# EAGLE design mic4606_power (EAGLE 6.4)

## Sheet 1 of 2
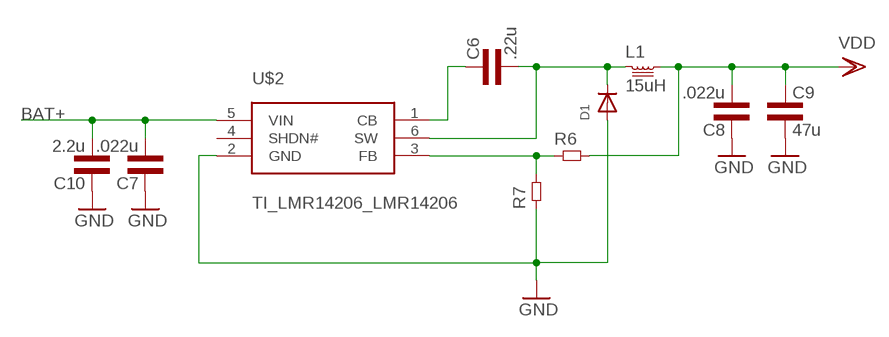
[diagram p0: schematic, sheet 1]

### Parts
C6  .22u  CAP0603L3  [0603L3]
C7  .022u  CAP0603L3  [0603L3]
C8  .022u  CAP0603L3  [0603L3]
C9  47u  CAP1210L3  [1210L3]
C10  2.2u  CAP1210L3  [1210L3]
D1  ADAFRUIT_DIODESMA  [ADAFRUIT_SMADIODE]
L1  15uH  NRG4026  [NR4026]
R6  RES0603L3  [0603L3]
R7  RES0603L3  [0603L3]
U$2  TI_LMR14206_LMR14206  [TI_LMR14206_R-PDSO-G6]

### Nets
BAT+: C7.P$2 C10.P$2 U$2.5(VIN) ; also sheet 2
CB: C6.P$1 U$2.1(CB)
FB: R6.P$1 R7.P$2 U$2.3(FB)
GND: C7.P$1 C8.P$1 C9.P$2 C10.P$1 D1.A R7.P$1 U$2.2(GND) ; also sheet 2
SW: C6.P$2 D1.C L1.E U$2.6(SW)
VDD: C8.P$2 C9.P$1 L1.F R6.P$2
Unconnected: U$2.4(SHDN#)

## Sheet 2 of 2
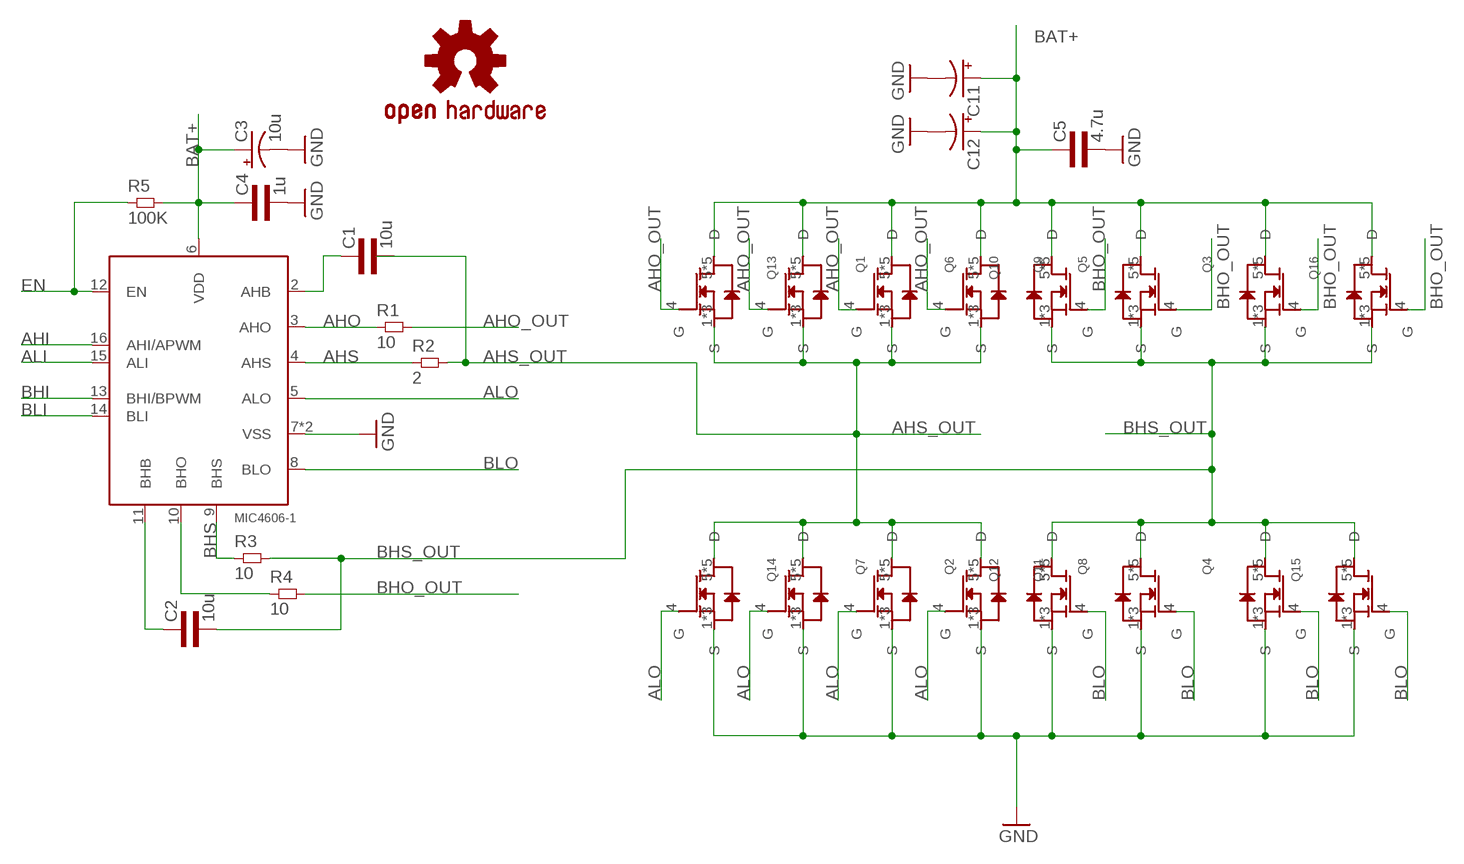
[diagram p1: schematic, sheet 2]

### Parts
C1  10u  CAP0805L3  [0805L3]
C2  10u  CAP0805L3  [0805L3]
C3  10u  CPOL-USE1.8-4  [E1,8-4]
C4  1u  CAP0603L3  [0603L3]
C5  4.7u  CAP0805L3  [0805L3]
C11  CPOL-USF  [PANASONIC_F]
C12  CPOL-USF  [PANASONIC_F]
LOGO1  OSHW-LOGOM  [OSHW-LOGO-M]
MD1  MIC4606-1  [QFN44-16LD-PL-2]
Q1  CSD18540Q5B  [Q5B]
Q2  CSD18540Q5B  [Q5B]
Q3  CSD18540Q5B  [Q5B]
Q4  CSD18540Q5B  [Q5B]
Q5  CSD18540Q5B  [Q5B]
Q6  CSD18540Q5B  [Q5B]
Q7  CSD18540Q5B  [Q5B]
Q8  CSD18540Q5B  [Q5B]
Q9  CSD18540Q5B  [Q5B]
Q10  CSD18540Q5B  [Q5B]
Q11  CSD18540Q5B  [Q5B]
Q12  CSD18540Q5B  [Q5B]
Q13  CSD18540Q5B  [Q5B]
Q14  CSD18540Q5B  [Q5B]
Q15  CSD18540Q5B  [Q5B]
Q16  CSD18540Q5B  [Q5B]
R1  10  RES0805L3  [0805L3]
R2  2  RES0805L3  [0805L3]
R3  10  RES0805L3  [0805L3]
R4  10  RES0805L3  [0805L3]
R5  100K  RES0603L3  [0603L3]

### Nets
AHI: MD1.16(AHI/APWM)
AHO: MD1.3(AHO) R1.1
AHO_OUT: Q1.4(G) Q6.4(G) Q9.4(G) Q13.4(G) R1.2
AHS: MD1.4(AHS) R2.1
AHS_OUT: C1.2 Q1.1(S) Q1.2(S) Q1.3(S) Q2.5(D) Q2.6(D) Q2.7(D) Q2.8(D) Q2.9(D) Q6.1(S) Q6.2(S) Q6.3(S) Q7.5(D) Q7.6(D) Q7.7(D) Q7.8(D) Q7.9(D) Q9.1(S) Q9.2(S) Q9.3(S) Q11.5(D) Q11.6(D) Q11.7(D) Q11.8(D) Q11.9(D) Q13.1(S) Q13.2(S) Q13.3(S) Q14.5(D) Q14.6(D) Q14.7(D) Q14.8(D) Q14.9(D) R2.2
ALI: MD1.15(ALI)
ALO: MD1.5(ALO) Q2.4(G) Q7.4(G) Q11.4(G) Q14.4(G)
BAT+: C3.+ C4.P$1 C5.1 C11.+ C12.+ MD1.6(VDD) Q1.5(D) Q1.6(D) Q1.7(D) Q1.8(D) Q1.9(D) Q3.5(D) Q3.6(D) Q3.7(D) Q3.8(D) Q3.9(D) Q5.5(D) Q5.6(D) Q5.7(D) Q5.8(D) Q5.9(D) Q6.5(D) Q6.6(D) Q6.7(D) Q6.8(D) Q6.9(D) Q9.5(D) Q9.6(D) Q9.7(D) Q9.8(D) Q9.9(D) Q10.5(D) Q10.6(D) Q10.7(D) Q10.8(D) Q10.9(D) Q13.5(D) Q13.6(D) Q13.7(D) Q13.8(D) Q13.9(D) Q16.5(D) Q16.6(D) Q16.7(D) Q16.8(D) Q16.9(D) R5.P$2 ; also sheet 1
BHI: MD1.13(BHI/BPWM)
BHO: MD1.10(BHO) R4.1
BHO_OUT: Q3.4(G) Q5.4(G) Q10.4(G) Q16.4(G) R4.2
BHS: MD1.9(BHS) R3.1
BHS_OUT: C2.2 Q3.1(S) Q3.2(S) Q3.3(S) Q4.5(D) Q4.6(D) Q4.7(D) Q4.8(D) Q4.9(D) Q5.1(S) Q5.2(S) Q5.3(S) Q8.5(D) Q8.6(D) Q8.7(D) Q8.8(D) Q8.9(D) Q10.1(S) Q10.2(S) Q10.3(S) Q12.5(D) Q12.6(D) Q12.7(D) Q12.8(D) Q12.9(D) Q15.5(D) Q15.6(D) Q15.7(D) Q15.8(D) Q15.9(D) Q16.1(S) Q16.2(S) Q16.3(S) R3.2
BLI: MD1.14(BLI)
BLO: MD1.8(BLO) Q4.4(G) Q8.4(G) Q12.4(G) Q15.4(G)
EN: MD1.12(EN) R5.P$1
GND: C3.- C4.P$2 C5.2 C11.- C12.- MD1.7(VSS) MD1.TP(VSS) Q2.1(S) Q2.2(S) Q2.3(S) Q4.1(S) Q4.2(S) Q4.3(S) Q7.1(S) Q7.2(S) Q7.3(S) Q8.1(S) Q8.2(S) Q8.3(S) Q11.1(S) Q11.2(S) Q11.3(S) Q12.1(S) Q12.2(S) Q12.3(S) Q14.1(S) Q14.2(S) Q14.3(S) Q15.1(S) Q15.2(S) Q15.3(S) ; also sheet 1
N$1: C1.1 MD1.2(AHB)
N$9: C2.1 MD1.11(BHB)

## Library data of the parts
C1 C2 C4-C10 = common:CAP
C3 C11 C12 = rcl:CPOL-US: POLARIZED CAPACITOR, American symbol
D1 = logic_vB:ADAFRUIT_DIODE: Diode SMADIODE - SMA Surface Mount Package 20V 1A Schottky Diode Digikey: 641-1014-6-ND DO-1N4148 - Through Hole Small Current Diode SOD-123 20V 1 A (.5mV Vf) Schottky Diode - Digikey: MBRX120TPMSCT-ND SOD-323 10V 570mA (.38mV Vf, 3ns) Schottky Diode - Digikey: ZLLS410CT-ND SOD-523 30V 30mA Schottky Diode (RB751S-40TE61) - Digikey: RB751S-40TE61CT-ND SOT23-R/W - SOT23 Package (R = Solder Paste/Reflow Ovens, W = Hand-Soldering) BAT54Film 40V 300mA - Digikey: 497-7162-1-ND
L1 = common:NRG4026
LOGO1 = SparkFun-Aesthetics:OSHW-LOGO: Open Source Hardware Logo This logo indicates the piece of hardware it is found on incorporates a OSHW license and/or adheres to the definition of open source hardware found here: http://freedomdefined.org/OSHW
MD1 = common:MIC4606: 85V Full-Bridge Mosfet Driver
Q1-Q16 = common:CSD18540Q5B: N-Channel High-Power MosFET; I_MAX: 221A; PD: 195W; PULSED_DRAIN_CURRENT: 400A; VGS: +/- 20V; V_MAX: 60V
R1-R7 = common:RES
U$2 = logic_vB:TI_LMR14206_LMR14206

## Board
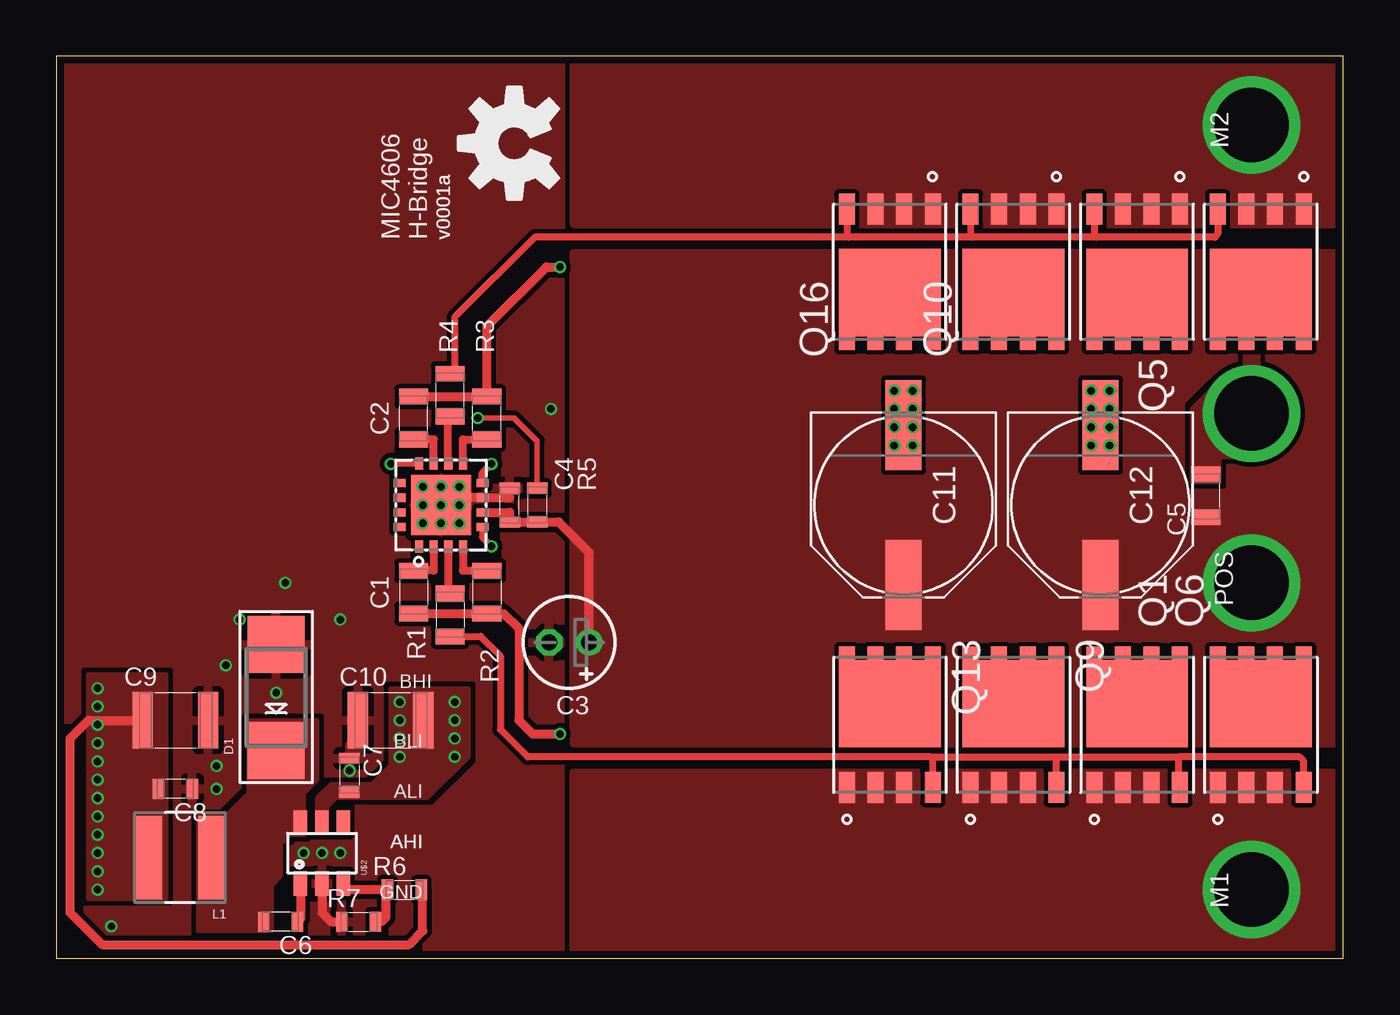
[diagram p2: board, top side]
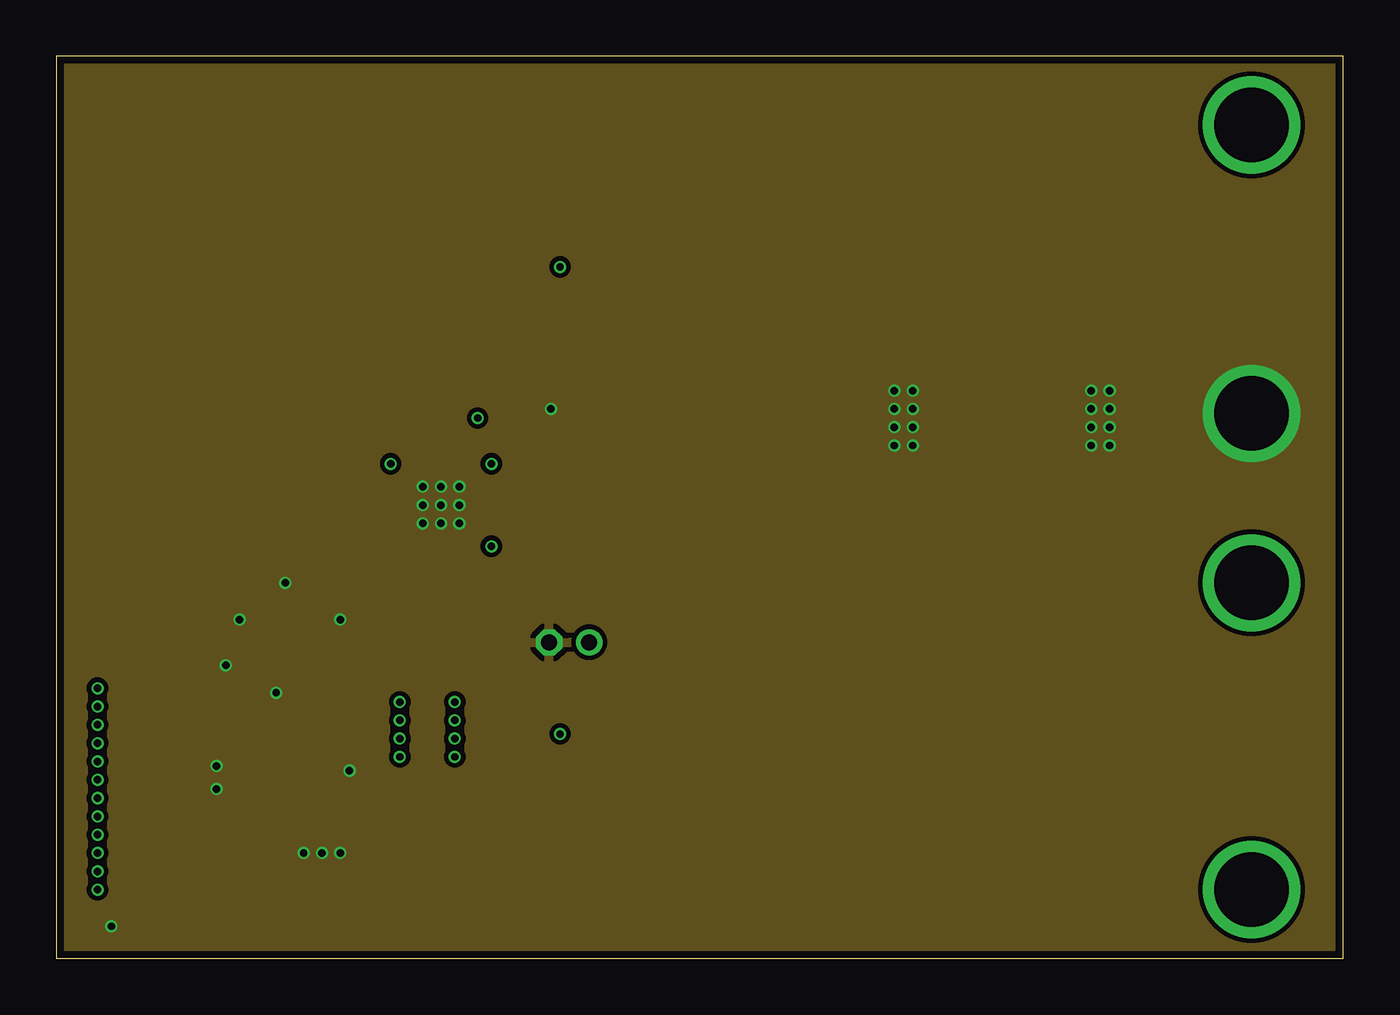
[diagram p3: board, inner layer Route2]
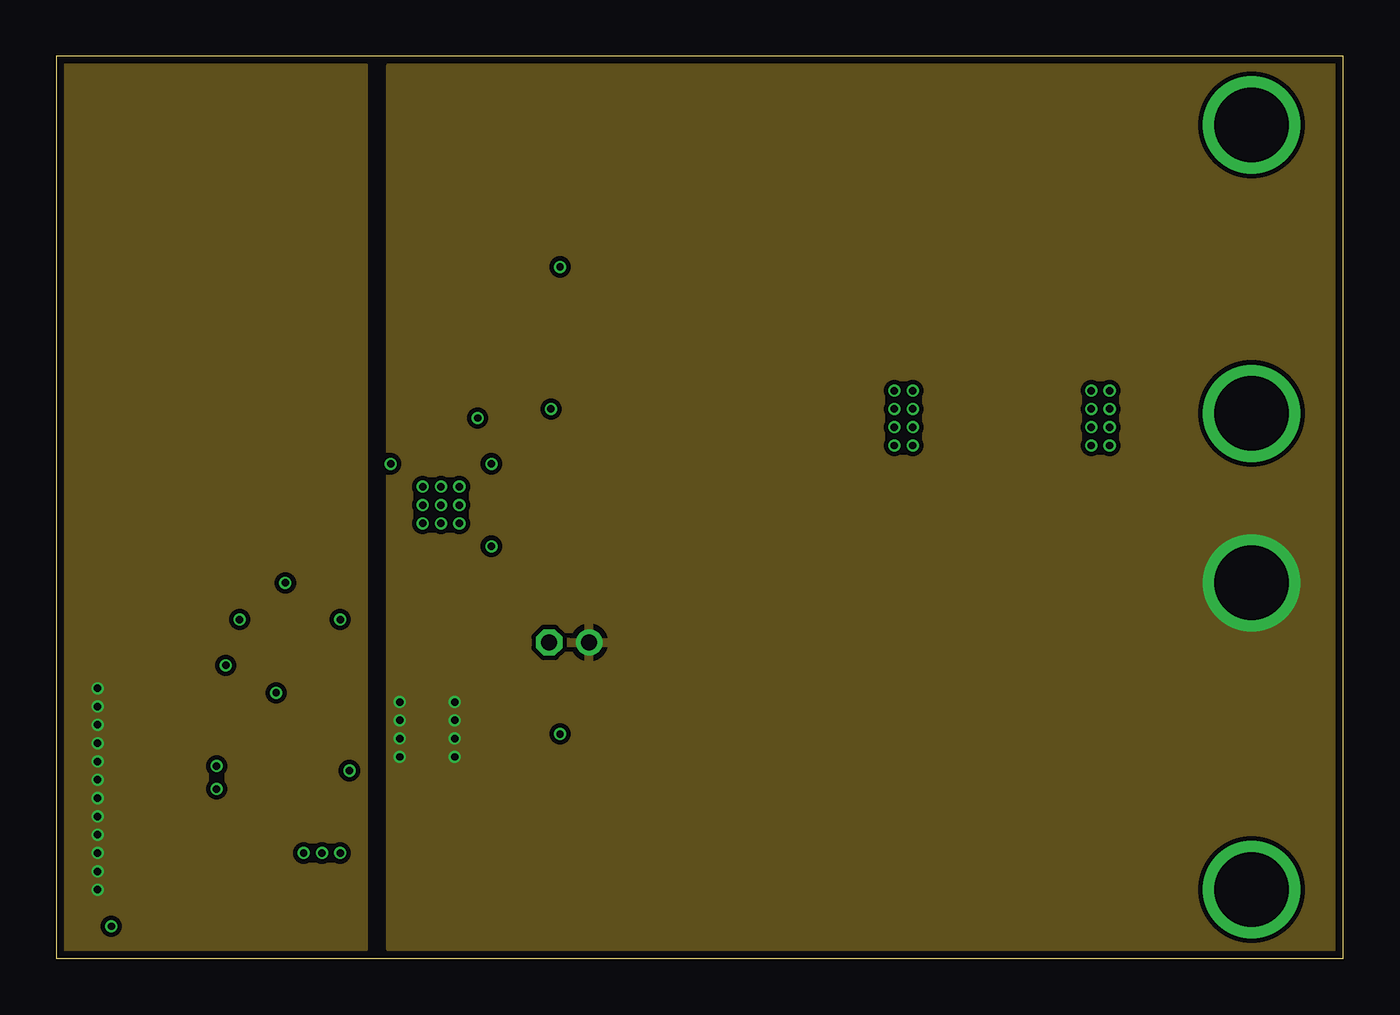
[diagram p4: board, inner layer Route3]
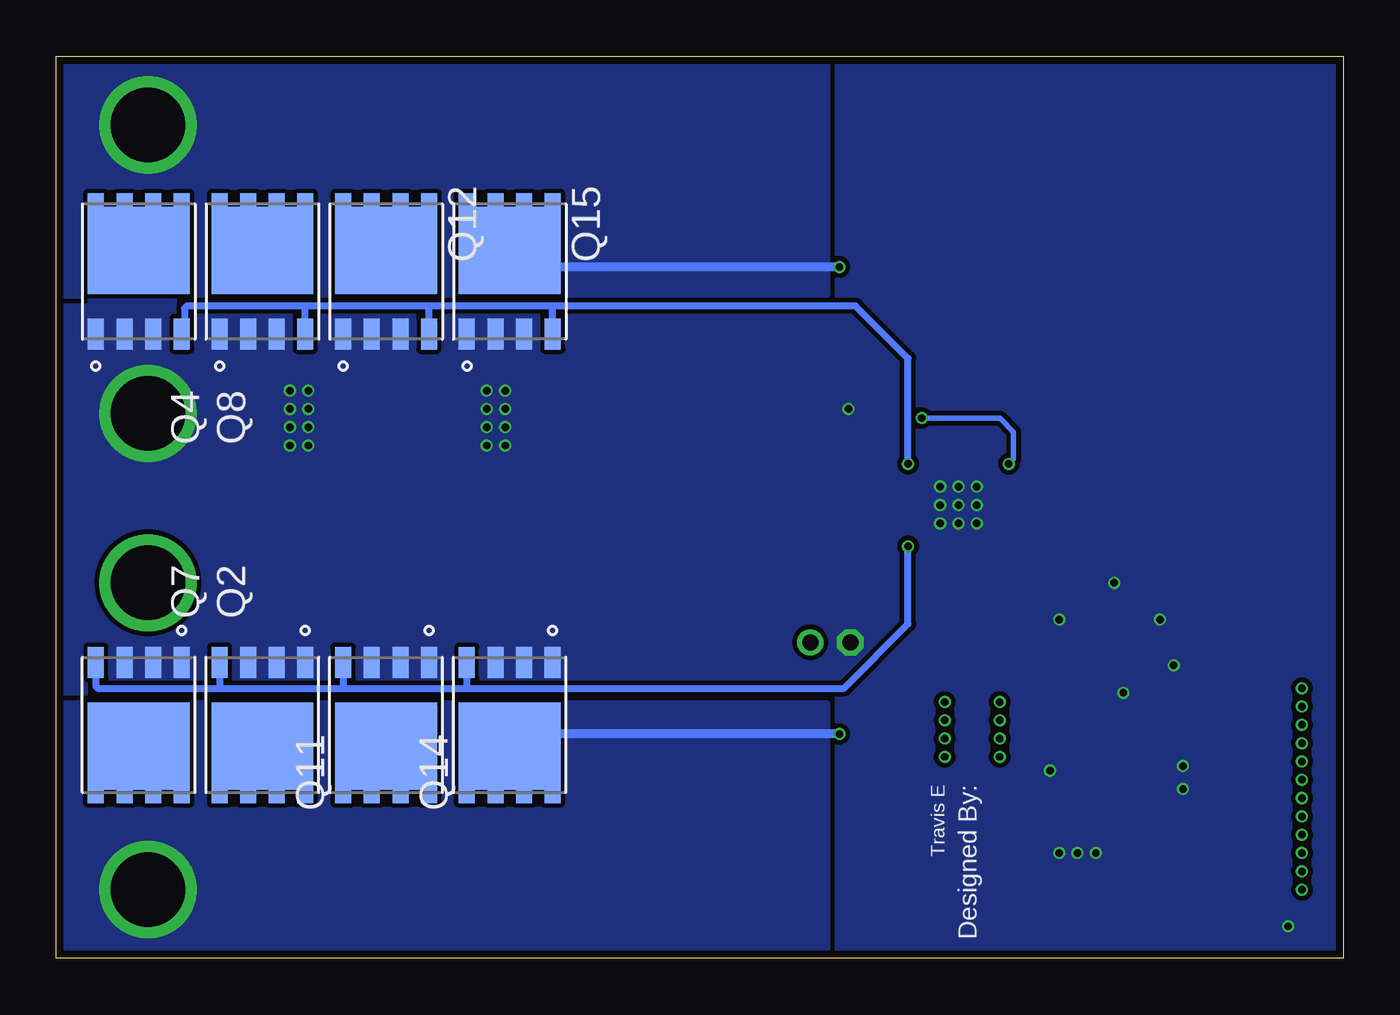
[diagram p5: board, bottom side, seen from below]

Size 57.1 x 40.03 mm. Coordinates in mm from the lower left corner, seen from the top.
Outline: 57.1,0 57.1,40.03 0,40.03 0,0 57.1,0
Copper layers (1*2*3*16): Top 0.035mm / dielectric 1.5mm / Route2 0.035mm / dielectric 0.15mm / Route3 0.035mm / dielectric 0.2mm / Bottom 0.035mm
Design rules "default *": minimum track width 8mil, minimum drill 13mil, track to track 8mil, track to pad 8mil, pad to pad 8mil, via to via 8mil, smd to smd 8mil, copper to edge 13mil, drill to drill 8mil, minimum pad ring 4mil, minimum via ring 4mil, stop-mask expansion 4mil, vias tented up to drill 13mil, thermal gap 10mil

### Footprints (pad centres in the part's own frame; a part is rotated, then mirrored left to right if it is on the bottom)
0805L3 = smd 0.7 x 1.3: 1 -0.95,0; 2 0.95,0
E1,8-4 = drill 0.711 pad 1.168: + -0.889,0 | drill 0.711 pad 1.168 octagon: - 0.889,0
0603L3 = smd 0.5 x 0.9: P$1 -0.75,0; P$2 0.75,0
1210L3 = smd 0.9 x 2.5: P$1 -1.45,0; P$2 1.45,0
PANASONIC_F = smd 4 x 1.6: + 3.55,0; - -3.55,0
ADAFRUIT_SMADIODE = smd 2.54 x 2.54: A 2.349,0; C -2.349,0
NR4026 = smd 1.2 x 3.7: E -1.4,0; F 1.4,0
QFN44-16LD-PL-2 = smd 0.53 x 0.36: 1 -1.835,0.975; 2 -1.835,0.325; 3 -1.835,-0.325; 4 -1.835,-0.975; 9 1.835,-0.975; 10 1.835,-0.325; 11 1.835,0.325; 12 1.835,0.975 | smd 0.36 x 0.53: 5 -0.975,-1.835; 6 -0.325,-1.835; 7 0.325,-1.835; 8 0.975,-1.835; 13 0.975,1.835; 14 0.325,1.835; 15 -0.325,1.835; 16 -0.975,1.835 | smd 2.65 x 2.65: TP 0,0
Q5B = smd 1.372 x 0.71: 1 2.77,-1.905; 2 2.77,-0.635; 3 2.77,0.635; 4 2.77,1.905 | smd 0.59 x 0.71: 5 -3.161,1.905; 6 -3.161,0.635; 7 -3.161,-0.635; 8 -3.161,-1.905 | smd 3.85 x 4.52: 9 -0.941,0
TI_LMR14206_R-PDSO-G6 = smd 0.6 x 1.1: 1 -0.95,-1.35; 2 0,-1.35; 3 0.95,-1.35; 4 0.95,1.35; 5 0,1.35; 6 -0.95,1.35

### Placement (x,y rotation side)
C1  15.85,16.26 270 top
C2  15.85,23.98 90 top
C3  22.76,14.02 180 top
C4  20.12,20.12 90 top
C5  51,20.52 90 top
C6  9.96,1.63 180 top
C7  13,8.13 270 top
C8  5.28,7.52 180 top
C9  5.28,10.57 0 top
C10  14.83,10.57 0 top
C11  37.59,20.12 270 top
C12  46.33,20.12 270 top
D1  9.75,11.58 90 top
L1  5.49,4.47 180 top
LOGO1  20.32,36.17 90 top
MD1  17.07,20.12 90 top
Q1  47.96,10.36 270 top
Q2  47.96,10.36 90 bottom
Q3  53.44,30.48 90 top
Q4  53.44,30.48 270 bottom
Q5  47.96,30.48 90 top
Q6  53.44,10.36 270 top
Q7  53.44,10.36 90 bottom
Q8  47.96,30.48 270 bottom
Q9  42.47,10.36 270 top
Q10  42.47,30.48 90 top
Q11  42.47,10.36 90 bottom
Q12  42.47,30.48 270 bottom
Q13  36.98,10.36 270 top
Q14  36.98,10.36 90 bottom
Q15  36.98,30.48 270 bottom
Q16  36.98,30.48 90 top
R1  17.48,15.24 270 top
R2  19.1,16.26 270 top
R3  19.1,23.98 90 top
R4  17.48,24.99 90 top
R5  21.34,20.12 270 top
R6  15.44,3.05 0 top
R7  13.41,1.63 0 top
U$2  11.79,4.67 0 top

### Tracks (layer width: path | path; a pad name or v marks a point on that pad's centre or on a via)
AHO
  Top 0.356: MD1.3 17.39,16.19
  Top 0.406: 17.39,16.19 R1.1
AHO_OUT
  Top 0.305: 38.81,8.94 44.5,8.94 | 44.5,8.94 49.78,8.94 | 49.78,8.94 49.78,7.67 | Q6.4 55.35,8.76 55.17,8.94 49.78,8.94 | Q9.4 44.37,8.81 44.5,8.94 | Q13.4 38.89,8.76 38.81,8.94 | R1.2 18.83,14.29 19.71,13.41 19.71,10.16 20.93,8.94 38.81,8.94
  Top 0.406: 49.78,7.67 Q1.4
AHS
  Top 0.356: MD1.4 18.04,17.21 R2.1
AHS_OUT  (via drill 0.33, 3.3)
  Top 0.406: C1.2 R2.2 | 19.17,15.24 R2.2 | R2.2 19.85,15.31 20.52,14.63 20.52,10.57 21.13,9.96 v22.35,9.96
  Bottom 0.406: v22.35,9.96 35.63,9.96
  other vias: 53.04,3.05
  pour Top (no thermals): 22.96,8.23 56.69,8.23 56.69,0.41 22.96,0.41
  pour Bottom (no thermals): 22.96,11.28 22.96,0.41 56.69,0.41 56.69,11.28
ALO  (via drill 0.33)
  Top 0.305: MD1.5 18.9,18.69 v19.3,18.29
  Top 0.356: MD1.5
  Bottom 0.305: Q7.4 55.35,12.06 55.27,11.99 49.78,11.99 | 49.78,11.99 44.3,11.99 | 44.3,11.99 38.81,11.99 | 38.81,11.99 22.15,11.99 19.3,14.83 v19.3,18.29 | Q14.4 38.89,12.06 38.81,11.99 | Q11.4 44.37,12.06 44.3,11.99 | Q2.4 49.86,12.06 49.78,11.99
BAT+  (via drill 0.33, 3.3)
  Top 0.406: MD1.6 20.12,19.79 C4.P$1 R5.P$2 22.29,19.37 23.65,18.01 C3.+
  other vias: 53.04,16.66 17.68,8.94 17.68,9.75 17.68,10.57 17.68,11.38 15.24,8.94 15.24,9.75 15.24,10.57 15.24,11.38
  pour Top (rank 2, no thermals): 22.96,9.55 22.96,31.29 56.69,31.29 56.69,9.55
  pour Route3: 14.83,0.41 14.83,39.62 56.69,39.62 56.69,0.41
  pour Top (no thermals): 11.99,5.69 11.99,6.71 12.4,7.11 16.46,7.11 18.29,8.94 18.29,11.99 14.83,11.99 14.83,8.53 14.02,7.72 12.19,7.72 11.58,7.11 11.58,5.69
BHO
  Top 0.356: MD1.10 17.39,24.04
  Top 0.406: 17.39,24.04 R4.1
BHO_OUT
  Top 0.305: Q3.4 51.54,32.13 51.41,32 46.13,32 | 46.13,32 40.64,32 | 40.64,32 35.15,32 | 35.15,32 21.23,32 17.68,28.45 17.68,26.15 | Q16.4 35.08,32.08 35.15,32 | Q10.4 40.56,32.08 40.64,32 | Q5.4 46.05,32.08 46.13,32
  Top 0.406: 17.68,26.15 R4.2
BHS
  Top 0.356: MD1.9 18.04,23.03 R3.1
BHS_OUT  (via drill 0.33, 3.3)
  Top 0.406: C2.2 R3.2 19.1,28.04 21.74,30.68 v22.35,30.68
  Bottom 0.406: v22.35,30.68 35.43,30.68
  other vias: 53.04,36.98
  pour Top (no thermals): 22.96,32.61 56.69,32.61 56.69,39.62 22.96,39.62
  pour Bottom (no thermals): 22.96,29.46 56.69,29.46 56.69,39.62 22.96,39.62
BLO  (via drill 0.33)
  Top 0.305: MD1.8 18.9,21.54 v19.3,21.95
  Top 0.356: MD1.8
  Bottom 0.305: v19.3,21.95 19.3,26.62 21.64,28.96 35.15,28.96 | 35.15,28.96 40.64,28.96 | 40.64,28.96 46.13,28.96 | 46.13,28.96 51.31,28.96 51.41,28.85 51.41,27.84 Q4.4 | Q8.4 46.05,28.88 46.13,28.96 | Q12.4 40.56,28.88 40.64,28.96 | Q15.4 35.08,28.88 35.15,28.96
CB
  Top 0.406: U$2.1 10.84,1.75 C6.P$1
EN  (via drill 0.33)
  Top 0.254: R5.P$1 21.34,22.96 20.32,23.98 v18.69,23.98 | v14.83,21.95 MD1.12
  Bottom 0.254: v18.69,23.98 15.24,23.98 14.63,23.37 14.63,22.15 v14.83,21.95
FB
  Top 0.406: R7.P$2 14.43,1.63 14.63,1.83 14.63,2.98 R6.P$1 13.01,3.05 U$2.3
GND  (via drill 0.33, 3.3)
  Top 0.254: 17.39,20.44 MD1.TP
  Top 0.406: C4.P$2 20.12,20.44 MD1.7 17.39,20.44 | U$2.2 11.79,2.03 12.19,1.63 R7.P$1 | v45.92,23.57 46.23,23.57 C12.- | v37.19,23.57 37.5,23.57 C11.-
  other vias: 53.04,24.18 16.26,19.3 16.26,20.12 16.26,20.93 17.07,19.3 17.07,20.12 17.07,20.93 17.88,19.3 17.88,20.12 17.88,20.93 7.11,8.53 7.52,13 7.11,7.52 9.75,11.79 8.13,15.04 10.16,16.66 12.6,15.04 10.97,4.67 11.79,4.67 12.6,4.67 2.44,1.42 21.95,24.38 13,8.33 46.74,25.2 45.92,25.2 46.74,24.38 46.74,23.57 46.74,22.76 45.92,24.38 45.92,22.76 38,25.2 37.19,25.2 38,24.38 37.19,24.38 38,23.57 38,22.76 37.19,22.76
  pour Bottom (rank 6, no thermals): 0.41,0.41 0.41,39.62 56.69,39.62 56.69,0.41
  pour Top (rank 6): 0.41,0.41 0.41,39.62 56.69,39.62 56.69,0.41
  pour Top (no thermals): 51.61,21.13 51.61,22.15 52.43,22.96 54.05,22.96 54.05,25.4 51.41,25.4 50.39,24.38 50.39,21.13
  pour Route2: 0.41,0.41 0.41,39.62 56.69,39.62 56.69,0.41
N$1
  Top 0.356: MD1.2 16.74,17.21 C1.1
N$9
  Top 0.356: MD1.11 16.74,23.03 C2.1
SW
  pour Top (no thermals): 10.97,5.49 10.97,7.32 11.58,7.92 11.58,10.57 8.53,10.57 8.53,7.32 7.52,6.3 6.3,6.3 6.3,1.22 9.55,1.22 9.55,3.25 9.96,3.66 9.96,5.08 10.36,5.49
VDD  (via drill 0.33)
  Top 0.406: R6.P$2 16.26,2.98 16.26,1.22 15.65,0.61 2.03,0.61 0.61,2.03 0.61,9.75 1.42,10.57 C9.P$1
  Bottom 0.305: 1.84,7.94 v1.83,7.92
  other vias: 1.83,3.05 1.83,3.86 1.83,4.67 1.83,5.49 1.83,6.3 1.83,7.11 1.83,8.74 1.83,9.55 1.83,10.36 1.83,11.18 1.83,11.99
  pour Top (no thermals): 4.88,2.64 1.42,2.64 1.42,12.6 4.88,12.6
  pour Route3: 0.41,0.41 0.41,39.62 13.61,39.62 13.61,0.41

### Text on the board
tPlace: M2 | MIC4606 | H-Bridge | v0001a | v0001a | v0001a | POS | BHI | BLI | ALI | AHI | AHI | GND | M1
bPlace: Designed By: | Travis E